# EAGLE design ArduinoISP_32U4_v3 (EAGLE 9.6.2)
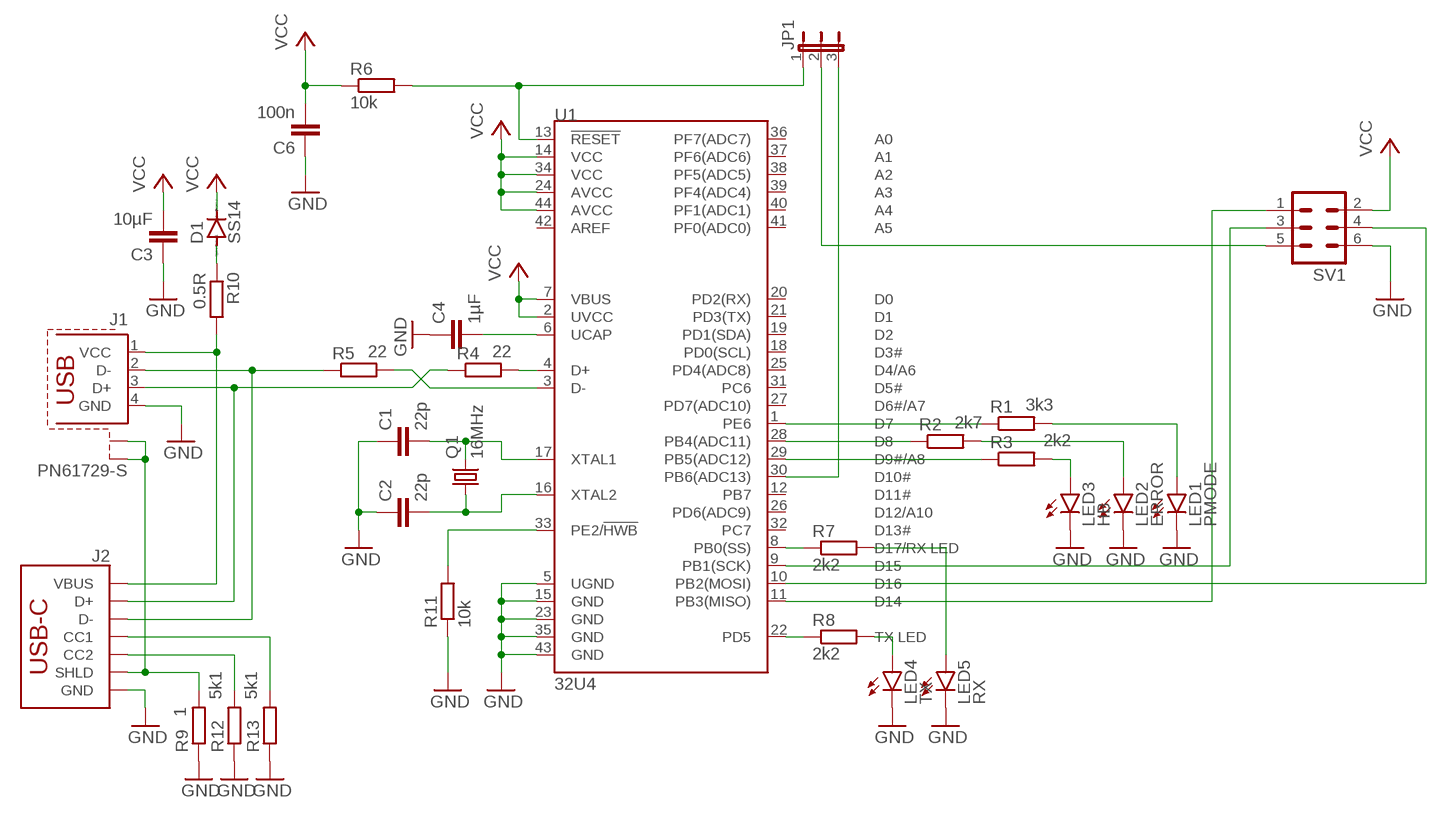
[diagram p0: schematic, sheet 1]

## Parts
C1  22p  C-EUC1206  [C1206]
C2  22p  C-EUC1206  [C1206]
C3  10µF  C-EUC1206  [C1206]
C4  1µF  C-EUC1206  [C1206]
C6  100n  C-EUC1206  [C1206]
D1  SS14  DIODE-DO214AC  [DO214AC]
J1  PN61729-S  [PN61729-S]
J2  USB_C_2-LAYER_PADS  [USB-C-16P-2LAYER-PADS]
JP1  JP2E  [JP2]
LED1  PMODE  LEDCHIPLED_1206  [CHIPLED_1206]
LED2  ERROR  LEDCHIPLED_1206  [CHIPLED_1206]
LED3  HB  LEDCHIPLED_1206  [CHIPLED_1206]
LED4  TX  LEDCHIPLED_1206  [CHIPLED_1206]
LED5  RX  LEDCHIPLED_1206  [CHIPLED_1206]
Q1  16MHz  CRYSTALHC49UP  [HC49UP]
R1  3k3  R-EU_R1206  [R1206]
R2  2k7  R-EU_R1206  [R1206]
R3  2k2  R-EU_R1206  [R1206]
R4  22  R-EU_R1206  [R1206]
R5  22  R-EU_R1206  [R1206]
R6  10k  R-EU_R1206  [R1206]
R7  2k2  R-EU_R1206  [R1206]
R8  2k2  R-EU_R1206  [R1206]
R9  1  R-EU_R1206  [R1206]
R10  0.5R  R-EU_R1206  [R1206]
R11  10k  R-EU_R1206  [R1206]
R12  5k1  R-EU_R1206  [R1206]
R13  5k1  R-EU_R1206  [R1206]
SV1  ML6  [ML6]
U1  32U4  ATMEGA32U4TQFP-44  [TQFP44]

## Nets
GND: C1.1 C2.1 C3.1 C4.1 C6.1 J1.4(GND) J2.GND J2.GND2(GND) LED1.C LED2.C LED3.C LED4.C LED5.C R9.1 R11.1 R12.1 R13.1 SV1.6 U1.5(UGND) U1.15(GND) U1.23(GND) U1.35(GND) U1.43(GND)
N$1: R5.2 U1.3(D-)
N$2: J1.3(D+) J2.A6(D+) J2.B6(D+) R4.1
N$3: SV1.3 U1.9(PB1(SCK))
N$4: C4.2 U1.6(UCAP)
N$5: SV1.1 U1.11(PB3(MISO))
N$6: SV1.4 U1.10(PB2(MOSI))
N$7: JP1.3 U1.30(PB6(ADC13))
N$8: JP1.2 SV1.5
N$9: JP1.1 R6.2 U1.13(!RESET)
N$10: R2.1 U1.28(PB4(ADC11))
N$11: R1.1 U1.1(PE6)
N$12: R3.1 U1.29(PB5(ADC12))
N$13: LED3.A R3.2
N$14: LED2.A R2.2
N$15: LED1.A R1.2
N$16: C1.2 Q1.2 Q1.22 U1.17(XTAL1)
N$17: C2.2 Q1.1 Q1.11 U1.16(XTAL2)
N$18: R4.2 U1.4(D+)
N$19: J1.2(D-) J2.A7(D-) J2.B7(D-) R5.1
N$21: D1.A R10.1
N$22: J1.1(VCC) J2.VBUS1(VBUS) J2.VBUS2(VBUS) R10.2
N$23: R8.1 U1.22(PD5)
N$24: R7.1 U1.8(PB0(SS))
N$25: LED4.A R8.2
N$26: LED5.A R7.2
N$27: J1.S1 J1.S2 J2.SHLD1(SHLD) J2.SHLD2(SHLD) J2.SHLD3(SHLD) J2.SHLD4(SHLD) R9.2
N$28: R11.2 U1.33(PE2/!HWB)
N$29: J2.B5(CC2) R12.2
N$30: J2.A5(CC1) R13.2
VCC: C3.2 C6.2 D1.C R6.1 SV1.2 U1.2(UVCC) U1.7(VBUS) U1.14(VCC) U1.24(AVCC) U1.34(VCC) U1.44(AVCC)
Unconnected: U1.12(PB7) U1.18(PD0(SCL)) U1.19(PD1(SDA)) U1.20(PD2(RX)) U1.21(PD3(TX)) U1.25(PD4(ADC8)) U1.26(PD6(ADC9)) U1.27(PD7(ADC10)) U1.31(PC6) U1.32(PC7) U1.36(PF7(ADC7)) U1.37(PF6(ADC6)) U1.38(PF5(ADC5)) U1.39(PF4(ADC4)) U1.40(PF1(ADC1)) U1.41(PF0(ADC0)) U1.42(AREF)

## Library data of the parts
C1-C4 C6 = rcl-custom:C-EU: CAPACITOR, European symbol; SPICEPREFIX: C
D1 = diode-custom:DIODE-: DIODE
J1 = con-berg-custom:PN61729-S: BERG USB connector; OC_FARNELL: unknown; OC_NEWARK: unknown
J2 = SparkFun-Connectors-custom:USB_C: USB Type C 16Pin Connector Super Speed pins not available on the 16-pin purely SMD connector so this part is best for USB 2.0 implementations. D1 and D2 are tied together enabling D+/- no matter which way the cable is plugged into the connector. The two channel configuration pins (CC1/2) are exposed. These are normally connected to ground via 5.1k resistors but can be reconfigured for high current/high power applications. **4-LAYER BOARD WARNING!!** If designing 4-layer board, make sure to select the variant _4-LAYER-ISOLATED. The linked footprint (USB-C-16-4LAYER-ISOLATED) includes some very necessary cutout polygons in the inner layers (2 and 15). This prevents the PTH mounting shield legs on the USB connector from electrically connecting any other polygons on the inner layers (usually VCC and GND).; PROD_ID: CONN-14122
JP1 = jumper:JP2E: JUMPER
LED1-LED5 = led-custom:LED: LED OSRAM: - CHIPLED LG R971, LG N971, LY N971, LG Q971, LY Q971, LO R971, LY R971 LH N974, LH R974 LS Q976, LO Q976, LY Q976 LO Q996 - Hyper CHIPLED LW Q18S LB Q993, LB Q99A, LB R99A - SideLED LS A670, LO A670, LY A670, LG A670, LP A670 LB A673, LV A673, LT A673, LW A673 LH A674 LY A675 LS A676, LA A676, LO A676, LY A676, LW A676 LS A679, LY A679, LG A679 - Hyper Micro SIDELED® LS Y876, LA Y876, LO Y876, LY Y876 LT Y87S - SmartLED LW L88C, LW L88S LB L89C, LB L89S, LG L890 LS L89K, LO L89K, LY L89K LS L896, LA L896, LO L896, LY L896 - TOPLED LS T670, LO T670, LY T670, LG T670, LP T670 LSG T670, LSP T670, LSY T670, LOP T670, LYG T670 LG T671, LOG T671, LSG T671 LB T673, LV T673, LT T673, LW T673 LH T674 LS T676, LA T676, LO T676, LY T676, LB T676, LH T676, LSB T676, LW T676 LB T67C, LV T67C, LT T67C, LS T67K, LO T67K, LY T67K, LW E67C LS E67B, LA E67B, LO E67B, LY E67B, LB E67C, LV E67C, LT E67C LW T67C LS T679, LY T679, LG T679 LS T770, LO T770, LY T770, LG T770, LP T770 LB T773, LV T773, LT T773, LW T773 LH T774 LS E675, LA E675, LY E675, LS T675 LS T776, LA T776, LO T776, LY T776, LB T776 LHGB T686 LT T68C, LB T68C - Hyper Mini TOPLED® LB M676 - Mini TOPLED Santana® LG M470 LS M47K, LO M47K, LY M47K Source: http://www.osram.convergy.de LUXEON: - LUMILED® LXK2-PW12-R00, LXK2-PW12-S00, LXK2-PW14-U00, LXK2-PW14-V00 LXK2-PM12-R00, LXK2-PM12-S00, LXK2-PM14-U00 LXK2-PE12-Q00, LXK2-PE12-R00, LXK2-PE12-S00, LXK2-PE14-T00, LXK2-PE14-U00 LXK2-PB12-K00, LXK2-PB12-L00, LXK2-PB12-M00, LXK2-PB14-N00, LXK2-PB14-P00, LXK2-PB14-Q00 LXK2-PR12-L00, LXK2-PR12-M00, LXK2-PR14-Q00, LXK2-PR14-R00 LXK2-PD12-Q00, LXK2-PD12-R00, LXK2-PD12-S00 LXK2-PH12-R00, LXK2-PH12-S00 LXK2-PL12-P00, LXK2-PL12-Q00, LXK2-PL12-R00 Source: www.luxeon.com KINGBRIGHT: KA-3528ASYC Source: www.kingbright.com
Q1 = crystal-custom:CRYSTAL: CRYSTAL; OC_FARNELL: unknown; OC_NEWARK: unknown
R1-R13 = rcl-custom:R-EU_: RESISTOR, European symbol; SPICEPREFIX: R
SV1 = con-ml-custom:ML6: HARTING; OC_FARNELL: unknown; OC_NEWARK: unknown
U1 = SparkFun-IC-Microcontroller:ATMEGA32U4: Atmel MCU, 32KByte Atmel 44-pin 8-bit Microcontroller with 32KBytes of ISP Flash and USB Controller Datasheet <http://cdn.sparkfun.com/datasheets/Dev/Arduino/Boards/ATMega32U4.pdf> SparkFun Products LilyPad Arduino USB - ATmega32U4 Board <https://www.sparkfun.com/products/12049> (DEV-12049) Pro Micro - 5V/16MHz <https://www.sparkfun.com/products/12640> (DEV-12640) Pro Micro - 3.3V/8MHz <https://www.sparkfun.com/products/12587> (DEV-12587) Fio v3 - ATmega32U4 <https://www.sparkfun.com/products/11520> (DEV-11520) Qduino Mini <https://www.sparkfun.com/products/13614> (DEV-13614) Makey Makey - Standard Kit <https://www.sparkfun.com/products/11511> (WIG-11511) Makey Makey Deluxe Kit <https://www.sparkfun.com/products/11519> (WIG-11519); PROD_ID: IC-11161

## Board
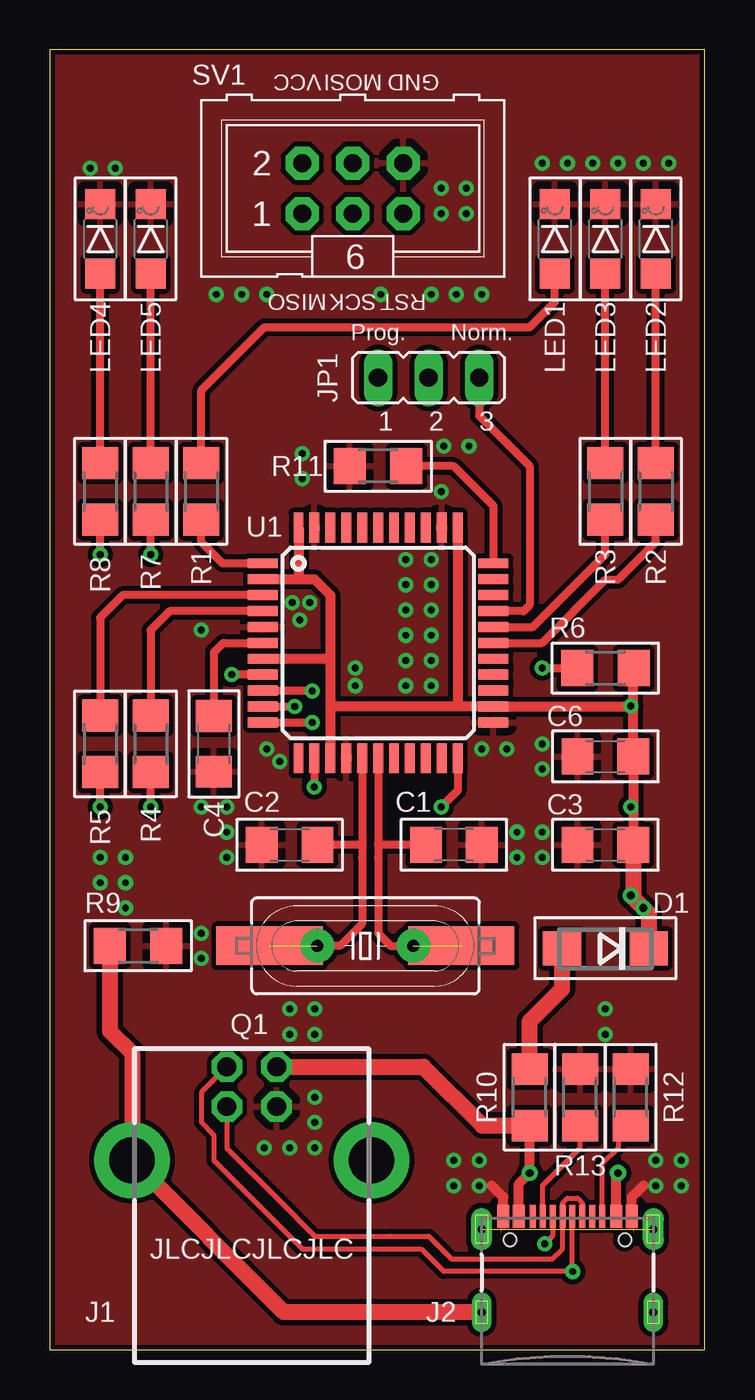
[diagram p1: board, top side]
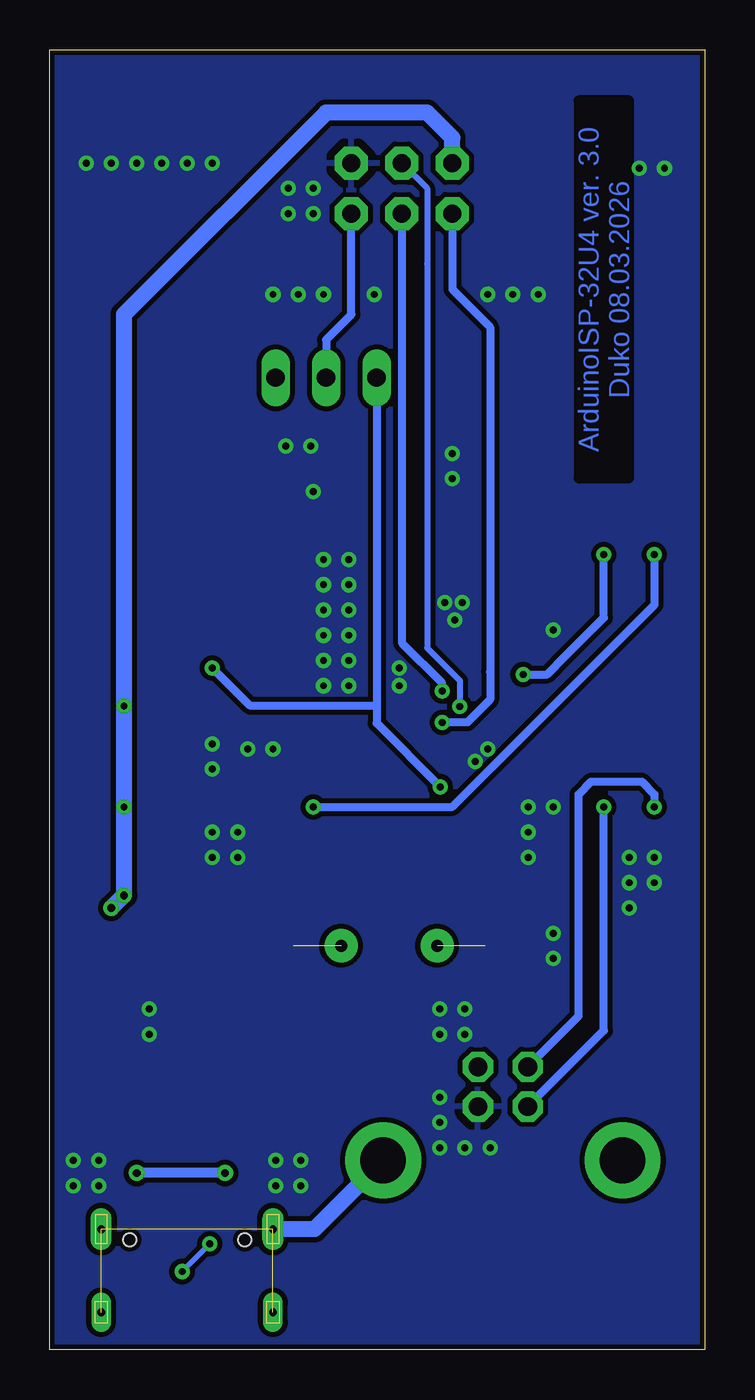
[diagram p2: board, bottom side, seen from below]

Size 32.94 x 65.39 mm. Coordinates in mm from the lower left corner, seen from the top.
Outline: 0,0 32.94,0 32.94,65.39 0,65.39 0,0
Copper layers (1*16): Top 0.035mm / dielectric 1.5mm / Bottom 0.035mm
Design rules "default *": minimum track width 6mil, minimum drill 0.35mm, track to track 6mil, track to pad 6mil, pad to pad 6mil, via to via 6mil, smd to smd 6mil, copper to edge 10mil, drill to drill 6mil, minimum pad ring 10mil, minimum via ring 8mil, stop-mask expansion 4mil, vias tented up to drill 14mil, thermal gap 16mil

### Footprints (pad centres in the part's own frame; a part is rotated, then mirrored left to right if it is on the bottom)
C1206 = smd 1.6 x 1.8: 1 -1.4,0; 2 1.4,0
DO214AC = smd 1.927 x 1.7: A 2.177,0; C -2.177,0
PN61729-S = drill 0.95 pad 1.524 octagon: 1 1.25,4.71; 2 -1.25,4.71; 3 -1.25,2.71; 4 1.25,2.71 | drill 2.3 pad 3.81: S1 -6.02,0; S2 6.02,0
USB-C-16P-2LAYER-PADS = smd 0.3 x 1.152: A5 -1.25,-0.264; A6 -0.25,-0.264; A7 0.25,-0.264; A8 1.25,-0.264; B5 1.75,-0.264; B6 0.75,-0.264; B7 -0.75,-0.264; B8 -1.75,-0.264 | smd 0.6 x 1.152: GND -3.225,-0.264; GND2 3.225,-0.264; VBUS1 -2.45,-0.264; VBUS2 2.45,-0.264 | drill 0.4 pad 1.067 long: SHLD1 -4.318,-0.915; SHLD2 4.318,-0.915 | drill 0.4 pad 0.991 long: SHLD3 -4.318,-5.095; SHLD4 4.318,-5.095 | hole 0.65: -2.89,-1.445; 2.89,-1.445
JP2 = drill 0.914 long: 1 -2.54,0; 2 0,0; 3 2.54,0
CHIPLED_1206 = smd 1.5 x 1.5: A 0,-1.75; C 0,1.75
HC49UP = smd 5.334 x 1.93: 1 -4.826,0; 2 4.826,0 | drill 0.6 pad 1.676: 11 -2.413,0; 22 2.413,0
R1206 = smd 1.6 x 1.803: 1 -1.422,0; 2 1.422,0
ML6 = drill 0.914 pad 1.676 octagon: 1 -2.54,-1.27; 2 -2.54,1.27; 3 0,-1.27; 4 0,1.27; 5 2.54,-1.27; 6 2.54,1.27
TQFP44 = smd 1.5 x 0.5: 1 -5.8,4; 2 -5.8,3.2; 3 -5.8,2.4; 4 -5.8,1.6; 5 -5.8,0.8; 6 -5.8,0; 7 -5.8,-0.8; 8 -5.8,-1.6; 9 -5.8,-2.4; 10 -5.8,-3.2; 11 -5.8,-4; 23 5.8,-4; 24 5.8,-3.2; 25 5.8,-2.4; 26 5.8,-1.6; 27 5.8,-0.8; 28 5.8,0; 29 5.8,0.8; 30 5.8,1.6; 31 5.8,2.4; 32 5.8,3.2; 33 5.8,4 | smd 0.5 x 1.5: 12 -4,-5.8; 13 -3.2,-5.8; 14 -2.4,-5.8; 15 -1.6,-5.8; 16 -0.8,-5.8; 17 0,-5.8; 18 0.8,-5.8; 19 1.6,-5.8; 20 2.4,-5.8; 21 3.2,-5.8; 22 4,-5.8; 34 4,5.8; 35 3.2,5.8; 36 2.4,5.8; 37 1.6,5.8; 38 0.8,5.8; 39 0,5.8; 40 -0.8,5.8; 41 -1.6,5.8; 42 -2.4,5.8; 43 -3.2,5.8; 44 -4,5.8

### Placement (x,y rotation side)
C1  20.32,25.4 180 top
C2  12.06,25.4 0 top
C3  27.94,25.4 0 top
C4  8.26,30.48 90 top
C6  27.94,29.84 0 top
D1  27.94,20.19 180 top
J1  10.16,9.53 0 top
J2  26.04,6.99 0 top
JP1  19.05,48.9 0 top
LED1  25.4,55.88 0 top
LED2  30.48,55.88 0 top
LED3  27.94,55.88 0 top
LED4  2.54,55.88 0 top
LED5  5.08,55.88 0 top
Q1  15.88,20.32 0 top
R1  7.62,43.18 90 top
R2  30.48,43.18 90 top
R3  27.94,43.18 90 top
R4  5.08,30.48 90 top
R5  2.54,30.48 90 top
R6  27.94,34.29 180 top
R7  5.08,43.18 90 top
R8  2.54,43.18 90 top
R9  4.45,20.32 180 top
R10  24.13,12.7 270 top
R11  16.51,44.45 0 top
R12  29.21,12.7 270 top
R13  26.67,12.7 270 top
SV1  15.24,58.42 0 top
U1  16.51,35.56 0 top

### Tracks (layer width: path | path; a pad name or v marks a point on that pad's centre or on a via)
GND  (via drill 0.35)
  Top 0.508: J2.GND 22.81,7.67 22.23,8.26 | J2.GND2 29.26,7.67 29.84,8.26
  other vias: 12.19,37.59 13.08,37.59 12.57,36.7 15.37,34.29 15.37,33.4 19.18,33.4 17.91,33.4 17.91,34.67 19.18,34.67 19.18,35.94 17.91,35.94 17.91,37.21 19.18,37.21 19.18,38.48 17.91,38.48 17.91,39.75 19.18,39.75 22.99,30.23 21.72,30.23 10.92,30.23 11.56,29.59 9.65,53.09 8.38,53.09 19.18,53.09 20.45,53.09 21.59,8.26 21.59,9.53 20.32,9.53 20.32,8.26 30.48,8.26 30.48,9.53 31.75,9.53 31.75,8.26 13.34,12.7 13.34,11.43 12.06,10.16 10.79,10.16 8.89,26.04 8.89,24.77 23.5,24.77 23.5,26.04 24.77,26.04 24.77,24.77 24.77,30.48 24.77,29.21 7.62,27.3 8.89,27.3 12.7,45.09 12.7,43.81 19.68,43.18 7.62,36.2 24.77,59.69 26.04,59.69 27.3,59.69 28.57,59.69 29.84,59.69 31.11,59.69 19.68,58.42 20.95,58.42 19.68,57.15 20.95,57.15 19.81,45.47 21.08,45.47 16.64,53.09 21.72,53.09 10.92,53.09 27.94,15.88 27.94,17.14 7.62,20.95 7.62,19.68 3.81,22.23 3.81,23.5 2.54,23.5 3.81,24.77 2.54,24.77 13.34,15.88 12.06,15.88 13.34,10.16 13.34,17.14 12.06,17.14 2.03,59.44 3.3,59.44
  pour Bottom (isolate 0.254): -2.54,67.31 -2.54,-3.17 35.56,-3.17 35.56,67.31
  pour Top (isolate 0.254): -5.71,69.85 -5.71,-6.35 38.73,-6.35 38.73,69.85
N$1
  Top 0.406: U1.3 3.67,37.96 2.54,36.83 R5.2
N$2  (via drill 0.35)
  Top 0.254: J1.3 8.91,10.14 11.43,7.62 13.34,5.71 17.14,5.71 19.05,5.71 20.19,4.57 25.27,4.57 25.79,5.08 J2.A6 25.79,7.37 26.04,7.62 26.54,7.62 26.79,7.38 J2.B6
  Top 0.406: v5.08,27.3 R4.1
  Bottom 0.406: J1.3 6.5,14.65 5.08,16.07 v5.08,27.3
N$3  (via drill 0.35)
  Top 0.406: U1.9 13.2,33.16 v13.21,33.15
  Bottom 0.406: SV1.3 15.24,54.61 15.24,35.56 13.21,33.53 v13.21,33.15
N$4
  Top 0.406: U1.6 8.74,35.56 8.26,35.08 8.26,32.38 C4.2
N$5  (via drill 0.35)
  Top 0.406: U1.11 v13.21,31.56
  Bottom 0.406: SV1.1 12.7,53.34 10.79,51.44 10.79,34.1 10.79,32.7 11.94,31.56 v13.21,31.56
N$6  (via drill 0.35)
  Top 0.406: U1.10 v12.32,32.36 | v12.32,32.36
  Bottom 0.305: SV1.4 13.97,58.42 13.97,54.61 13.97,35.31 12.32,33.66 v12.32,32.36
N$7
  Top 0.406: JP1.3 21.59,46.99 24.13,44.45 24.13,37.47 23.82,37.16 U1.30
N$8
  Bottom 0.406: SV1.5 17.78,52.07 19.05,50.8 JP1.2
N$9  (via drill 0.35)
  Top 0.406: U1.13 v13.31,28.32 | v13.31,28.32 | v24.77,34.29 R6.2
  Bottom 0.406: v13.31,28.32 16.51,31.52 16.51,32.38 | JP1.1 16.51,32.38 | v24.77,34.29 22.86,32.38 16.51,32.38
N$10
  Top 0.406: U1.28 24.77,35.56 27.94,38.73 28.57,38.73 30.48,40.64 R2.1
N$11
  Top 0.406: U1.1 8.7,39.56 7.62,40.64 R1.1
N$12
  Top 0.406: R3.1 27.94,40.01 24.3,36.36 U1.29
N$13
  Top 0.406: R3.2 LED3.A
N$14
  Top 0.406: R2.2 LED2.A
N$15
  Top 0.406: R1.2 7.62,48.26 10.79,51.44 24.13,51.44 25.4,52.7 LED1.A
N$16  (1 unrouted)
  Top 0.406: U1.17 16.51,25.4 | 16.51,25.4 16.51,24.77 16.51,20.95 17.14,20.32 Q1.22 | C1.2 16.51,25.4
N$17  (1 unrouted)
  Top 0.406: U1.16 15.71,25.4 | 15.71,25.4 15.71,24.77 15.71,21.43 14.61,20.32 Q1.11 | 15.71,25.4 C2.2
N$18
  Top 0.406: U1.4 6.04,37.16 5.08,36.2 R4.2
N$19  (via drill 0.35)
  Top 0.254: J1.2 7.62,12.95 7.62,11.43 8.26,10.79 8.26,9.53 12.7,5.08 18.67,5.08 19.81,3.94 v26.29,3.94 J2.A7 | J2.B7 25.29,5.73 v24.89,5.33
  Top 0.406: v2.54,27.3 R5.1
  Bottom 0.254: v24.89,5.33 v26.29,3.94
  Bottom 0.406: v2.54,27.3 2.54,27.94 3.17,28.57 5.71,28.57 6.35,27.94 6.35,16.8 J1.2
N$21
  Top 0.813: R10.1 24.13,16.51 25.76,18.14 D1.A
N$22  (via drill 0.4)
  Top 0.508: J2.VBUS1 23.59,8.35 v24.13,8.89 R10.2 | J2.VBUS2 28.48,8.8 v28.57,8.89
  Top 0.813: R10.2 21.74,11.28 18.79,14.23 J1.1
  Bottom 0.508: v24.13,8.89 v28.57,8.89
N$23  (via drill 0.35)
  Top 0.406: U1.22 20.51,28.13 v19.68,27.3 | v2.54,40.01 R8.1
  Bottom 0.406: v2.54,40.01 2.54,37.47 12.7,27.3 v19.68,27.3
N$24  (via drill 0.35)
  Top 0.406: U1.8 10.7,33.97 v9.14,33.97 | v5.08,40.01 R7.1
  Bottom 0.406: v9.14,33.97 7.94,33.97 6.99,34.92 5.08,36.83 v5.08,40.01
N$25
  Top 0.406: R8.2 LED4.A
N$26
  Top 0.406: R7.2 LED5.A
N$27  (3 unrouted)
  Top 0.813: R9.2 3.02,16.03 4.14,14.91 J1.S1 11.78,1.89 J2.SHLD3
  Bottom 0.813: J1.S2 19.64,6.07 J2.SHLD1
N$28
  Top 0.406: U1.33 22.31,42.46 20.32,44.45 R11.2
N$29
  Top 0.254: J2.B5 27.79,9.37 28.57,10.16 28.57,10.64 R12.2
N$30
  Top 0.254: J2.A5 24.79,8.28 26.67,10.16 R13.2
VCC  (via drill 0.35, 0.4)
  Top 0.406: 12.51,38.76 12.06,38.76
  Top 0.508: U1.2 12.06,38.76 13.31,38.76 14.11,37.96 14.11,34.92 | U1.44 12.51,38.76 | 20.51,32.36 U1.24 29.32,32.36 29.34,32.38 | 20.51,32.36 14.13,32.36 14.11,32.38 | U1.34 20.51,32.36 | 14.11,34.92 14.11,32.38 | 14.11,32.38 U1.14 | 14.11,34.92 14.11,34.76 U1.7 | R6.1 29.21,34.29 29.34,34.16 29.34,32.38 | 29.34,32.38 C6.2 29.34,27.3 | 29.34,27.3 C3.2 | v29.21,27.3 29.34,27.3
  Top 0.813: D1.C 30.12,21.95 29.34,22.73 C3.2
  Bottom 0.813: SV1.2 12.7,60.96 13.97,62.23 19.05,62.23 29.21,52.07 v29.21,32.38 v29.21,27.3 v29.21,22.86 v29.84,22.23

### Text on the board
Bottom: ArduinoISP-32U4 ver. 3.0 / Duko 08.03.2026
tNames: VCC | MOSI | GND | MISO | SCK | RST | Prog. | Norm. | JLCJLCJLCJLC